# EAGLE design solar_charger_fuel_gauge_dev (EAGLE 6.6.0)
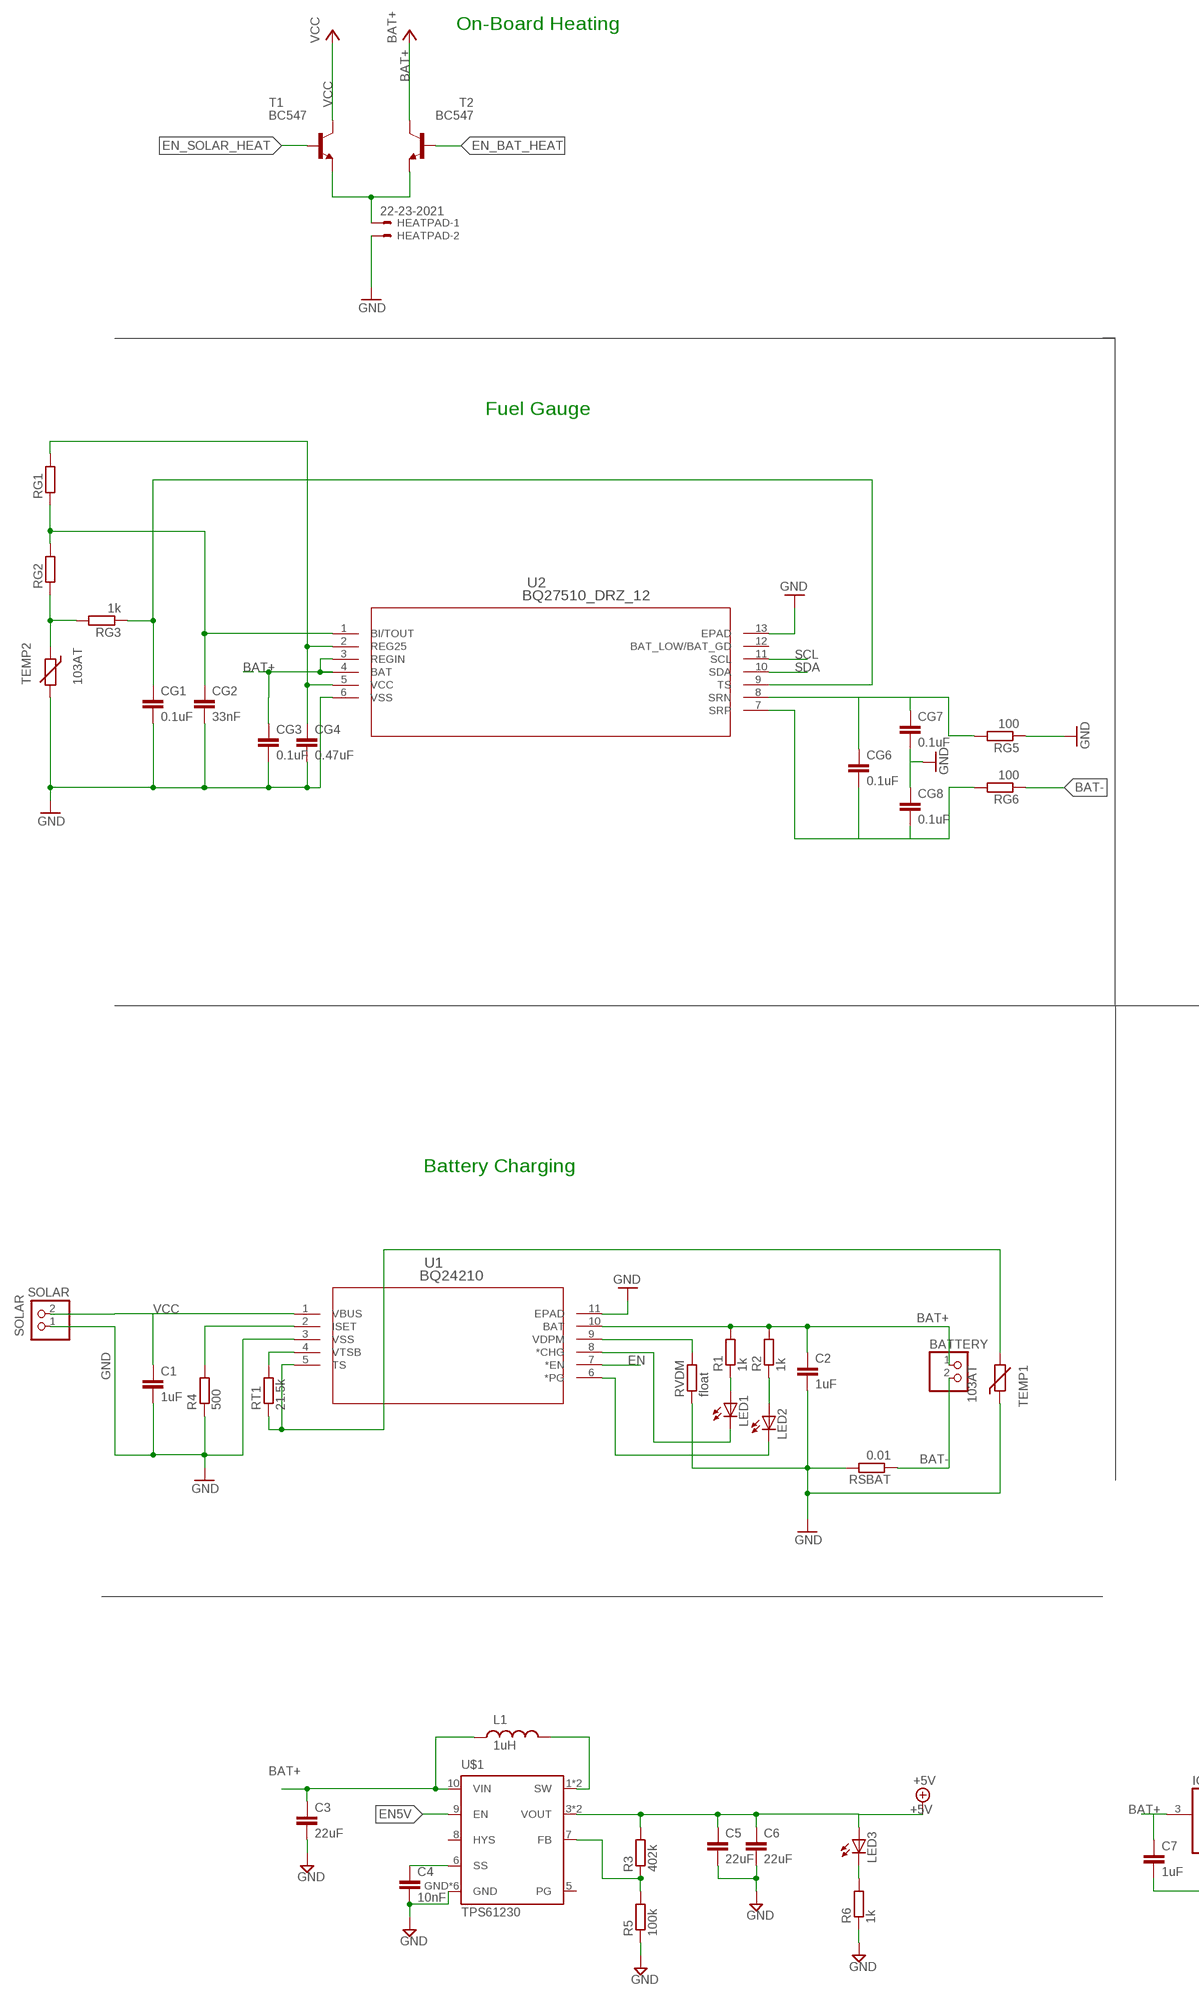
[diagram p0: schematic, sheet 1, part 1 of 3]
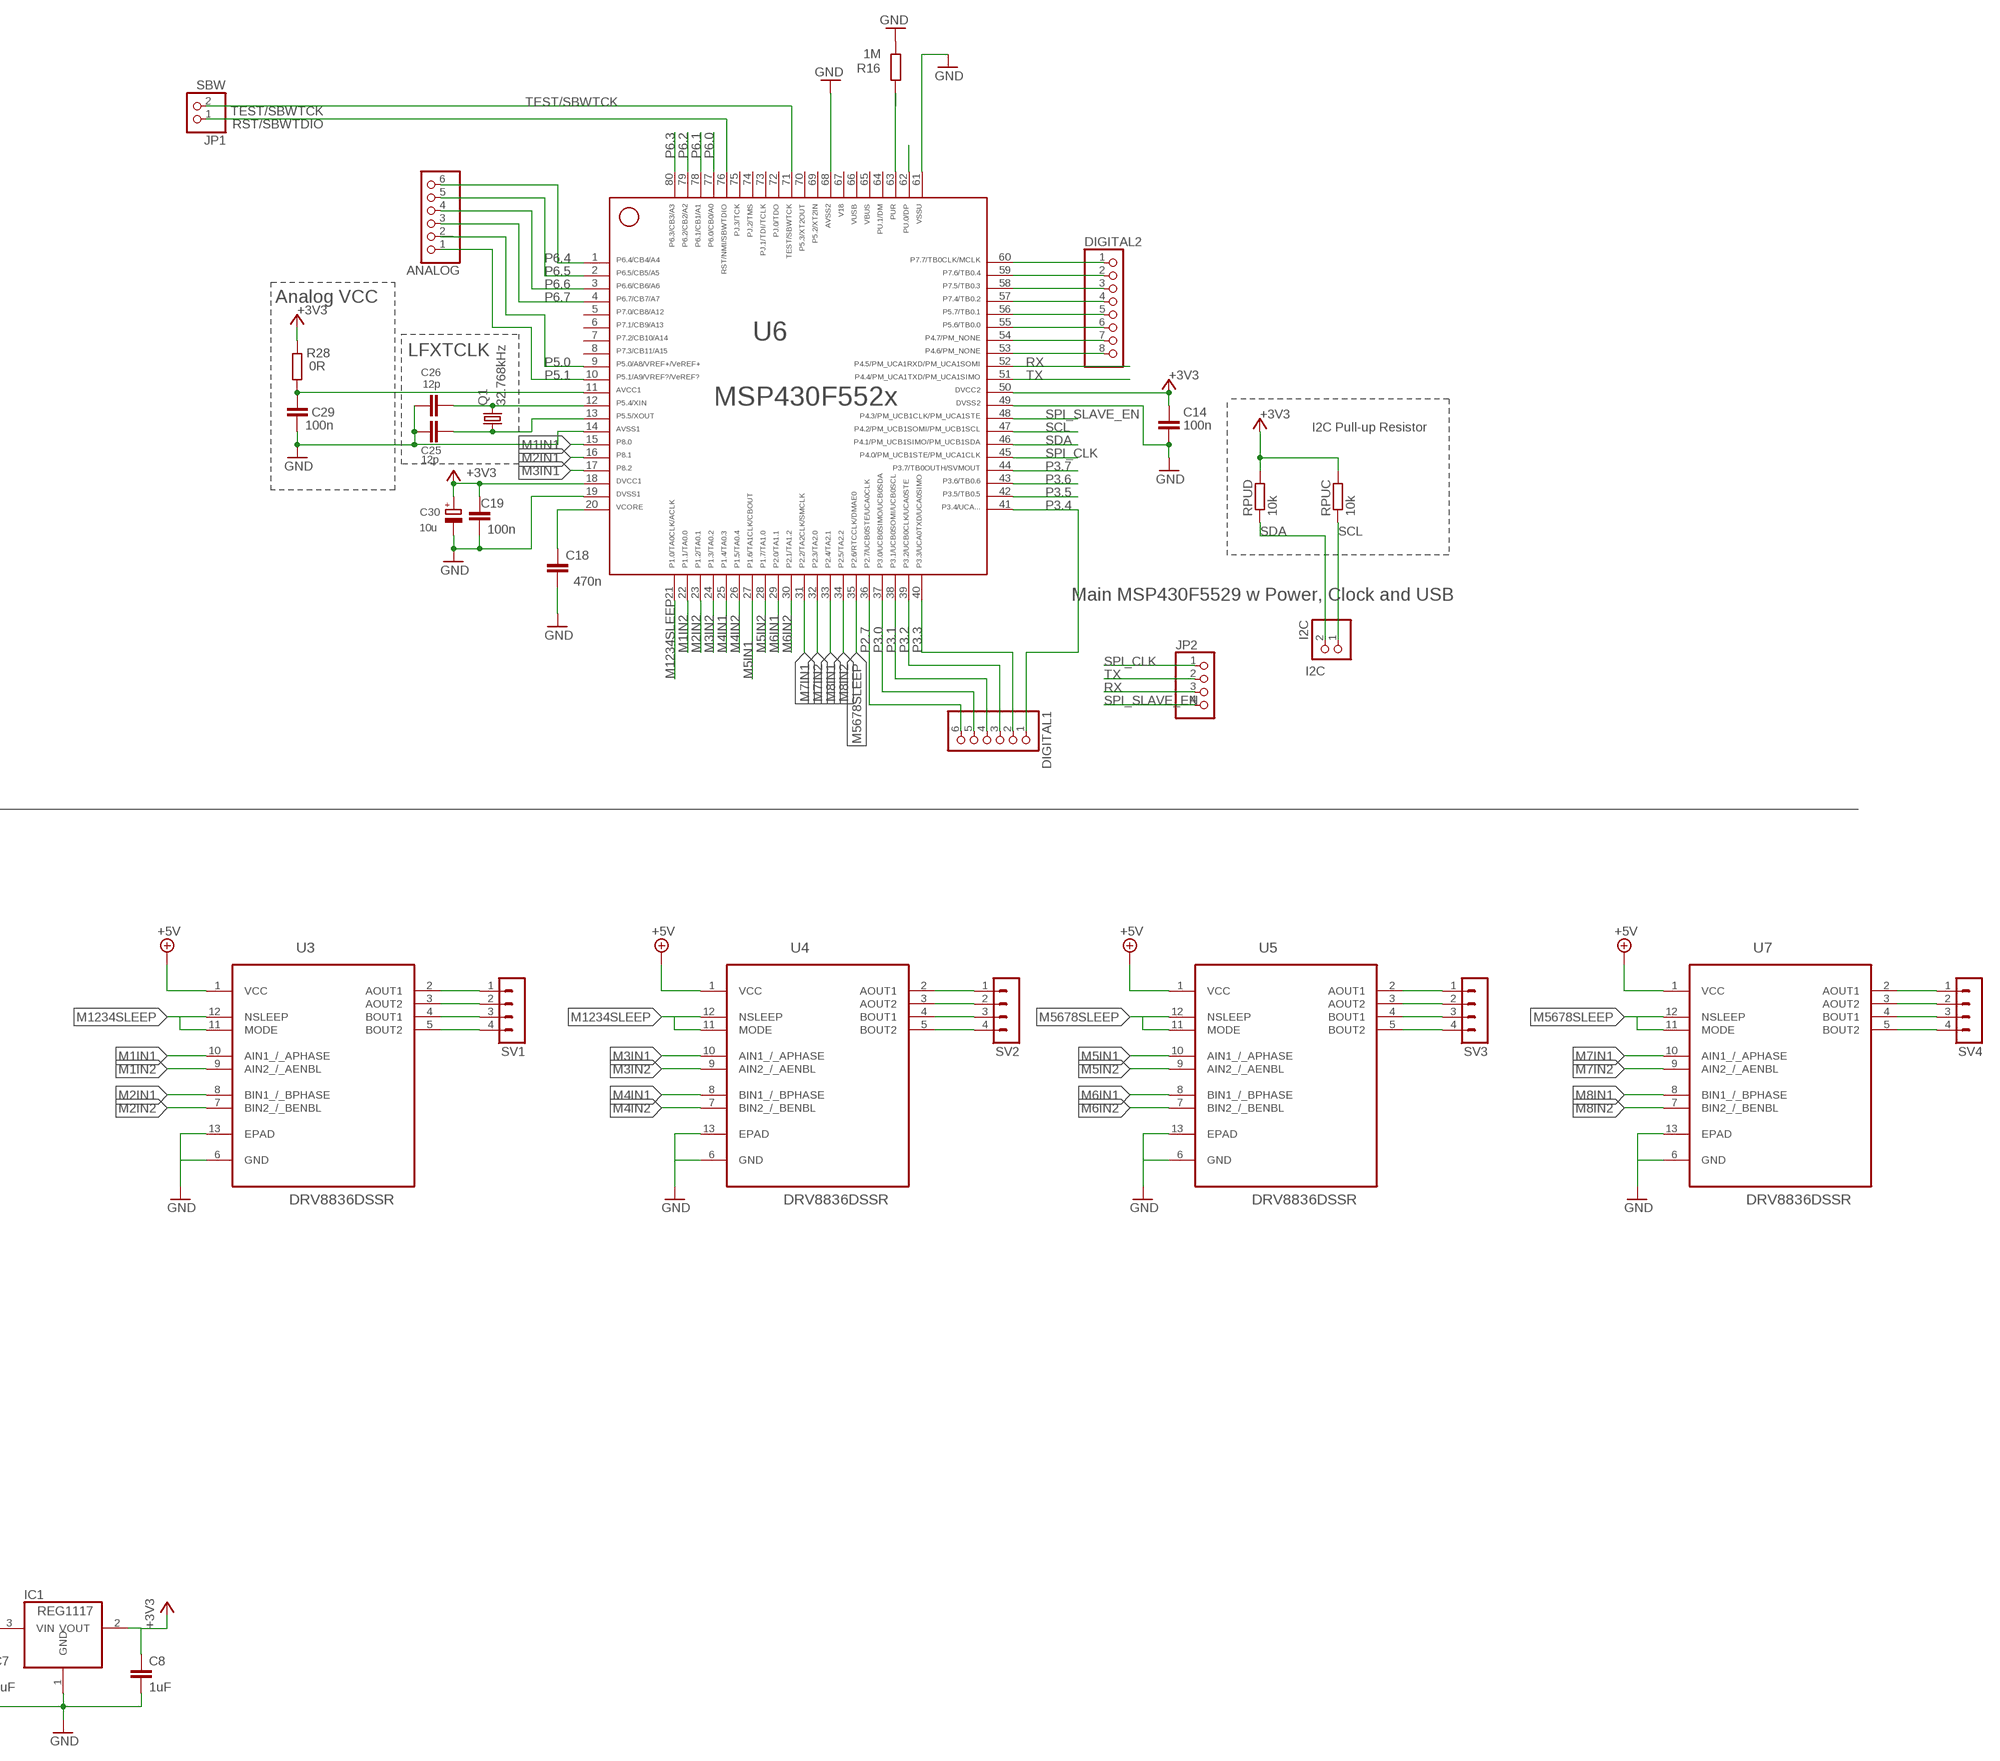
[diagram p1: schematic, sheet 1, part 2 of 3]
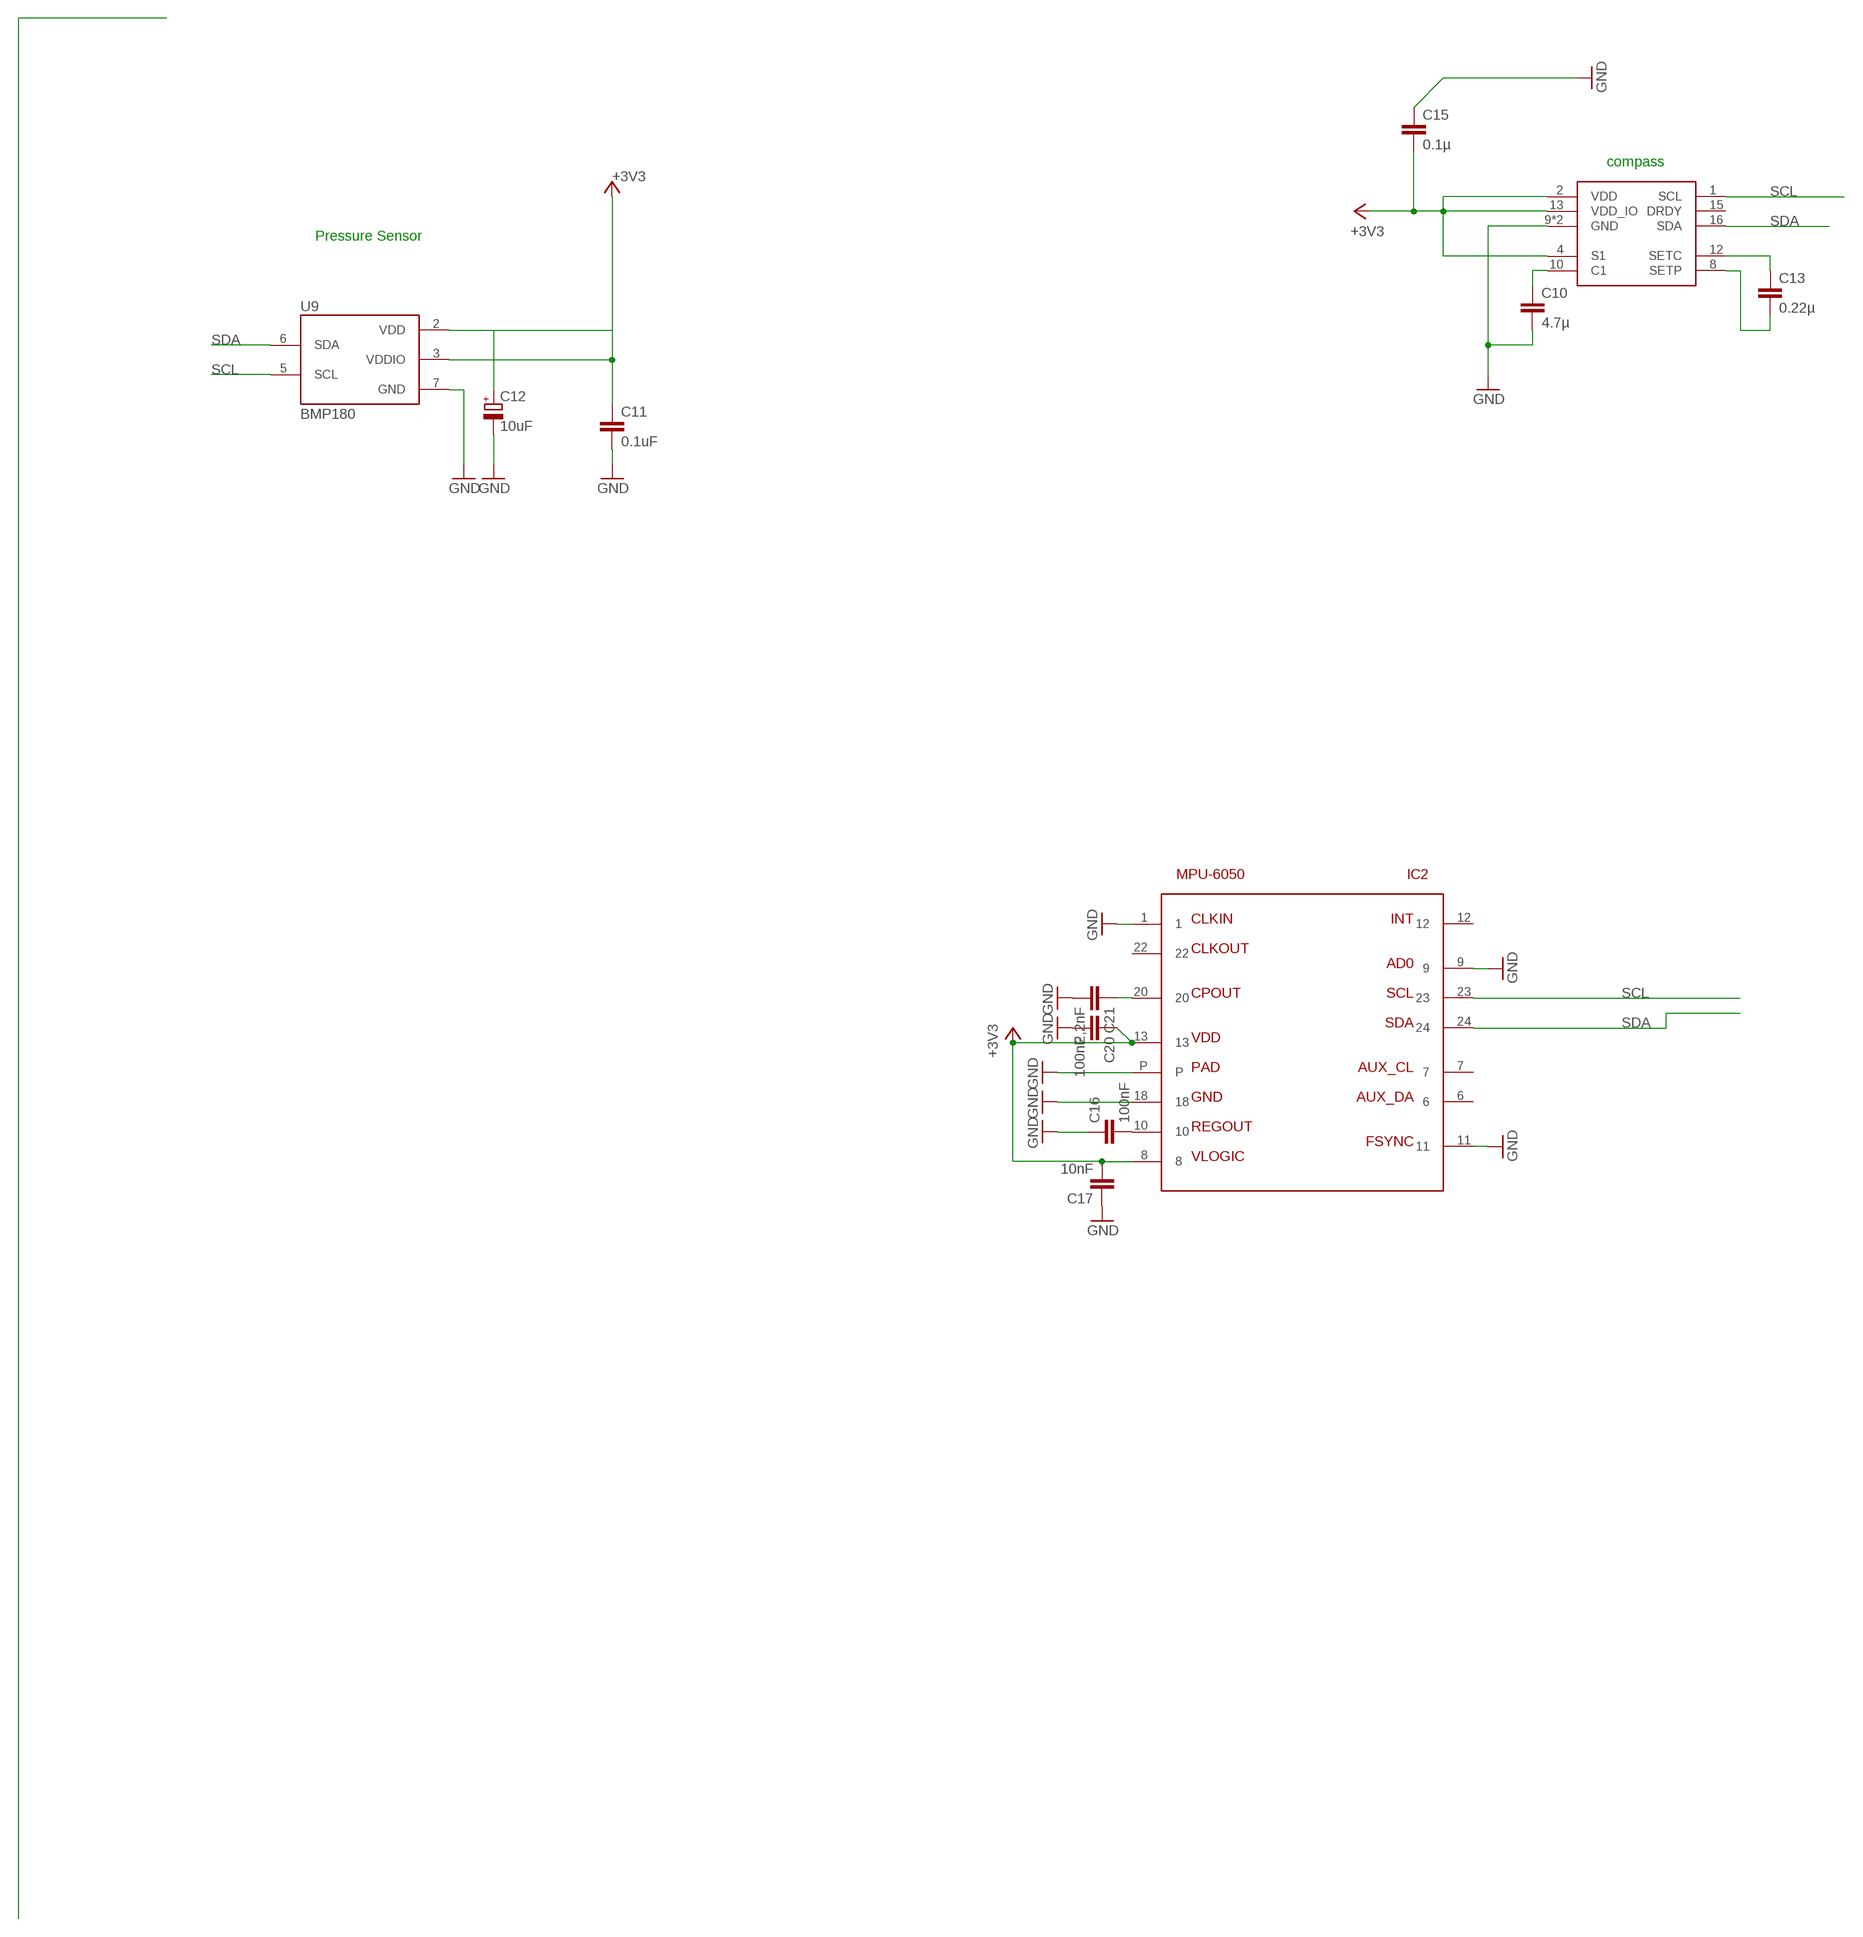
[diagram p2: schematic, sheet 1, part 3 of 3]

## Parts
ANALOG  PINHD-1X6  [1X06]
BATTERY  PINHD-1X2  [1X02]
C1  1uF  C-EUC1206  [C1206]
C2  1uF  C-EUC1206  [C1206]
C3  22uF  C-EUC0603  [C0603]
C4  10nF  C-EUC0603  [C0603]
C5  22uF  C-EUC0603  [C0603]
C6  22uF  C-EUC0603  [C0603]
C7  1uF  C-EUC0603  [C0603]
C8  1uF  C-EUC0603  [C0603]
C10  4.7µ  C-EUC0603  [C0603]
C11  0.1uF  C-EUC0603  [C0603]
C12  10uF  CPOL-EUA/3216-18R  [A/3216-18R]
C13  0.22µ  C-EUC0603  [C0603]
C14  100n  C-EUC0603  [C0603]
C15  0.1µ  C-EUC0603  [C0603]
C16  100nF  C-EUC0603  [C0603]
C17  10nF  C-EUC0603  [C0603]
C18  470n  C-EUC0603  [C0603]
C19  100n  C-EUC0603  [C0603]
C20  100nF  C-EUC0603  [C0603]
C21  2,2nF  C-EUC0603  [C0603]
C25  12p  C-EUC0603  [C0603]
C26  12p  C-EUC0603  [C0603]
C29  100n  C-EUC0603  [C0603]
C30  10u  CPOL-EUA/3216-18R  [A/3216-18R]
CG1  0.1uF  C-EUC0603  [C0603]
CG2  33nF  C-EUC0603  [C0603]
CG3  0.1uF  C-EUC0603  [C0603]
CG4  0.47uF  C-EUC0603  [C0603]
CG6  0.1uF  C-EUC0603  [C0603]
CG7  0.1uF  C-EUC0603  [C0603]
CG8  0.1uF  C-EUC0603  [C0603]
COMPASS  HMC5883L  [LPCC16]
DIGITAL1  PINHD-1X6  [1X06]
DIGITAL2  PINHD-1X8  [1X08]
HEATPAD  22-23-2021  [22-23-2021]
I2C  I2C  PINHD-1X2  [1X02]
IC1  REG1117  [SOT223]
IC2  MPU-6050  [QFN24]
JP1  SBW  PINHD-1X2  [1X02]
JP2  PINHD-1X4  [1X04]
L1  1uH  XFL4020  [XFL4020]
LED1  LEDCHIP-LED0603  [CHIP-LED0603]
LED2  LEDCHIP-LED0603  [CHIP-LED0603]
LED3  LEDCHIPLED_0603  [CHIPLED_0603]
Q1  32.768kHz  FC-12M  [FC-12M]
R1  1k  R-EU_R0603  [R0603]
R2  1k  R-EU_R0603  [R0603]
R3  402k  R-EU_R0603  [R0603]
R4  500  R-EU_R1206  [R1206]
R5  100k  R-EU_R0603  [R0603]
R6  1k  R-EU_R0603  [R0603]
R16  1M  R-EU_R0603  [R0603]
R28  0R  R-EU_R0603  [R0603]
RG1  R-EU_R0603  [R0603]
RG2  R-EU_R0603  [R0603]
RG3  1k  R-EU_R0603  [R0603]
RG5  100  R-EU_R0603  [R0603]
RG6  100  R-EU_R0603  [R0603]
RPUC  10k  R-EU_R0603  [R0603]
RPUD  10k  R-EU_R0603  [R0603]
RSBAT  0.01  R-EU_R1206  [R1206]
RT1  21.5k  R-EU_R1206  [R1206]
RVDM  float  R-EU_R1206  [R1206]
SOLAR  SOLAR  PINHD-1X2  [1X02]
SV1  MA04-1  [MA04-1]
SV2  MA04-1  [MA04-1]
SV3  MA04-1  [MA04-1]
SV4  MA04-1  [MA04-1]
T1  BC547  [TO92]
T2  BC547  [TO92]
TEMP1  103AT  THERMISTOR-2,5  [RS-2,5]
TEMP2  103AT  THERMISTOR-2,5  [RS-2,5]
U1  BQ24210  BQ24210_DQC_10  [DQC10_P84X2P4]
U2  BQ27510_DRZ_12  [DRZ12_1P95X2P45]
U3  DRV8836DSSR  [SON50P200X300X80-13N]
U4  DRV8836DSSR  [SON50P200X300X80-13N]
U5  DRV8836DSSR  [SON50P200X300X80-13N]
U6  MSP430F5529IPNR  F552X---PN80  [PN80]
U7  DRV8836DSSR  [SON50P200X300X80-13N]
U9  BMP180  [BMP180]
U$1  TPS61230  [DRC-S-PVSON-N11]

## Nets
+3V3: C8.1 C11.1 C12.+ C14.1 C15.2 C17.2 C19.2 C20.1 C30.+ COMPASS.2(VDD) COMPASS.4(S1) COMPASS.13(VDD_IO) IC1.2(VOUT) IC2.8 IC2.13 R28.2 RPUC.2 RPUD.2 U6.18 U6.50 U9.2(VDD) U9.3(VDDIO)
+5V [hPower]: C5.1 C6.1 LED3.A R3.2 U3.1(VCC) U4.1(VCC) U5.1(VCC) U7.1(VCC) U$1.3(VOUT) U$1.4(VOUT)
AVCC [Power]: C29.1 R28.1 U6.11
BAT+ [hPower]: BATTERY.1 C2.1 C3.1 C7.1 CG3.1 IC1.3(VIN) L1.P$1 R1.2 R2.2 T2.3(C) U1.10(BAT) U2.3(REGIN) U2.4(BAT) U$1.10(VIN)
BAT- [hGround]: BATTERY.2 RG6.1 RSBAT.1
EN: U1.7(*EN)
EN5V: U$1.9(EN)
EN_BAT_HEAT: T2.2(B)
EN_SOLAR_HEAT: T1.2(B)
GND [Ground]: C1.2 C2.2 C3.2 C4.2 C5.2 C6.2 C7.2 C8.2 C10.2 C11.2 C12.- C14.2 C15.1 C16.1 C17.1 C18.1 C19.1 C20.2 C21.2 C25.1 C26.1 C29.2 C30.- CG1.2 CG2.2 CG3.2 CG4.2 CG7.2 CG8.1 COMPASS.9(GND) COMPASS.11(GND) HEATPAD.2 IC1.1(GND) IC2.1 IC2.9 IC2.11 IC2.18 IC2.P R4.1 R5.1 R6.1 R16.1 RG5.1 RSBAT.2 RVDM.1 SOLAR.1 TEMP1.1 TEMP2.2 U1.3(VSS) U1.11(EPAD) U2.6(VSS) U2.13(EPAD) U3.6(GND) U3.13(EPAD) U4.6(GND) U4.13(EPAD) U5.6(GND) U5.13(EPAD) U6.14 U6.19 U6.49 U6.61 U6.68 U7.6(GND) U7.13(EPAD) U9.7(GND) U$1.GND U$1.GND@1(GND) U$1.GND@2(GND) U$1.GND@3(GND) U$1.GND@4(GND) U$1.GND@5(GND)
IND: L1.P$2 U$1.1(SW) U$1.2(SW)
M1IN1: U3.10(AIN1_/_APHASE) U6.15
M1IN2: U3.9(AIN2_/_AENBL) U6.22
M2IN1: U3.8(BIN1_/_BPHASE) U6.16
M2IN2: U3.7(BIN2_/_BENBL) U6.23
M3IN1: U4.10(AIN1_/_APHASE) U6.17
M3IN2: U4.9(AIN2_/_AENBL) U6.24
M4IN1: U4.8(BIN1_/_BPHASE) U6.25
M4IN2: U4.7(BIN2_/_BENBL) U6.26
M5IN1: U5.10(AIN1_/_APHASE) U6.27
M5IN2: U5.9(AIN2_/_AENBL) U6.28
M6IN1: U5.8(BIN1_/_BPHASE) U6.29
M6IN2: U5.7(BIN2_/_BENBL) U6.30
M7IN1: U6.31 U7.10(AIN1_/_APHASE)
M7IN2: U6.32 U7.9(AIN2_/_AENBL)
M8IN1: U6.33 U7.8(BIN1_/_BPHASE)
M8IN2: U6.34 U7.7(BIN2_/_BENBL)
M1234SLEEP: U3.11(MODE) U3.12(NSLEEP) U4.11(MODE) U4.12(NSLEEP) U6.21
M5678SLEEP: U5.11(MODE) U5.12(NSLEEP) U6.35 U7.11(MODE) U7.12(NSLEEP)
N$1: CG2.1 RG1.1 RG2.2 U2.1(BI/TOUT)
N$2: LED1.A R1.1
N$3: LED2.A R2.1
N$4: LED1.C U1.8(*CHG)
N$5: LED2.C U1.6(*PG)
N$6: RVDM.2 U1.9(VDPM)
N$7: RT1.1 TEMP1.2 U1.5(TS)
N$8: RT1.2 U1.4(VTSB)
N$10: R4.2 U1.2(ISET)
N$13: SV2.1 U4.2(AOUT1)
N$14: DIGITAL2.1 U6.60
N$15: DIGITAL2.2 U6.59
N$17: C10.1 COMPASS.10(C1)
N$18: C16.2 IC2.10
N$19: C21.1 IC2.20
N$20: DIGITAL2.3 U6.58
N$21: DIGITAL2.4 U6.57
N$22: DIGITAL2.5 U6.56
N$23: DIGITAL2.6 U6.55
N$24: DIGITAL2.7 U6.54
N$25: C13.2 COMPASS.8(SETP)
N$26: DIGITAL2.8 U6.53
N$32: C13.1 COMPASS.12(SETC)
N$33: RG2.1 RG3.2 TEMP2.1
N$34: CG1.1 RG3.1 U2.9(TS)
N$35: CG4.1 RG1.2 U2.2(REG25) U2.5(VCC)
N$36: CG6.1 CG7.1 RG5.2 U2.8(SRN)
N$37: HEATPAD.1 T1.1(E) T2.1(E)
N$38: CG6.2 CG8.2 RG6.2 U2.7(SRP)
N$39: SV2.2 U4.3(AOUT2)
N$40: SV2.3 U4.4(BOUT1)
N$41: SV2.4 U4.5(BOUT2)
N$42: C4.1 U$1.6(SS)
N$43: R3.1 R5.2 U$1.7(FB)
N$44: LED3.C R6.2
N$45: SV3.1 U5.2(AOUT1)
N$46: SV3.2 U5.3(AOUT2)
N$47: SV3.3 U5.4(BOUT1)
N$48: SV3.4 U5.5(BOUT2)
N$49: SV1.1 U3.2(AOUT1)
N$50: SV1.2 U3.3(AOUT2)
N$51: SV1.3 U3.4(BOUT1)
N$52: SV1.4 U3.5(BOUT2)
N$53: SV4.1 U7.2(AOUT1)
N$54: SV4.2 U7.3(AOUT2)
N$55: SV4.3 U7.4(BOUT1)
N$56: SV4.4 U7.5(BOUT2)
P2.7: DIGITAL1.6 U6.36
P3.0: DIGITAL1.5 U6.37
P3.1: DIGITAL1.4 U6.38
P3.2: DIGITAL1.3 U6.39
P3.3: DIGITAL1.2 U6.40
P3.4: DIGITAL1.1 U6.41
P3.5: U6.42
P3.6: U6.43
P3.7: U6.44
P5.0: ANALOG.2 U6.9
P5.1: ANALOG.1 U6.10
P5.4/XIN: C26.2 Q1.2 U6.12
P5.5/XOUT: C25.2 Q1.1 U6.13
P6.0: U6.77
P6.1: U6.78
P6.2: U6.79
P6.3: U6.80
P6.4: ANALOG.6 U6.1
P6.5: ANALOG.5 U6.2
P6.6: ANALOG.4 U6.3
P6.7: ANALOG.3 U6.4
RST/SBWTDIO: JP1.1 U6.76
RX: JP2.3 U6.52
SCL: COMPASS.1(SCL) I2C.1 IC2.23 RPUC.1 U2.11(SCL) U6.47 U9.5(SCL)
SDA: COMPASS.16(SDA) I2C.2 IC2.24 RPUD.1 U2.10(SDA) U6.46 U9.6(SDA)
SPI_CLK: JP2.1 U6.45
SPI_SLAVE_EN: JP2.4 U6.48
TARGET_DP: U6.62
TARGET_PUR: R16.2 U6.63
TEST/SBWTCK: JP1.2 U6.71
TX: JP2.2 U6.51
VCC: C1.1 SOLAR.2 T1.3(C) U1.1(VBUS)
VCORE [Power]: C18.2 U6.20
Unconnected: COMPASS.15(DRDY) IC2.6 IC2.7 IC2.12 IC2.22 U2.12(BAT_LOW/BAT_GD) U6.5 U6.6 U6.7 U6.8 U6.64 U6.69 U6.70 U6.72 U6.73 U6.74 U6.75 U$1.8(HYS)

## Notes on the sheet
- On-Board Heating
- compass
- Pressure Sensor
- Fuel Gauge
- Analog VCC
- LFXTCLK
- I2C Pull-up Resistor
- Main MSP430F5529 w Power, Clock and USB
- Battery Charging

## Power pins joined to a net without a drawn wire
65: U6.65
66: U6.66
67: U6.67
PG: U$1.5(PG)

## Library data of the parts
ANALOG DIGITAL1 = pinhead:PINHD-1X6: PIN HEADER
BATTERY I2C JP1 SOLAR = pinhead:PINHD-1X2: PIN HEADER
C1-C8 C10 C11 C13-C21 C25 C26 C29 CG1-CG4 CG6-CG8 = rcl:C-EU: CAPACITOR, European symbol
C12 = resistor:CPOL-EU: POLARIZED CAPACITOR, European symbol
C30 = rcl:CPOL-EU: POLARIZED CAPACITOR, European symbol
COMPASS = HMC5883L:HMC5883L
DIGITAL2 = pinhead:PINHD-1X8: PIN HEADER
HEATPAD = con-molex:22-23-2021: .100" (2.54mm) Center Header - 2 Pin; MF: MOLEX; MPN: 22-23-2021; OC_FARNELL: 1462926; OC_NEWARK: 25C3832
IC1 = burr-brown:REG1117: 800mA and 1A Low Dropout (LDO) Positive Regulator 1.8V, 2.5V, 2.85V, 3.3V, 5V, and Adj; MPN: REG1117; OC_FARNELL: 1097566; OC_NEWARK: 14P6981
IC2 = seb:MPU-6050
JP2 = pinhead:PINHD-1X4: PIN HEADER
L1 = Coilcraft:XFL4020
LED1 LED2 = led:LED: LED
LED3 = adafruit:LED: LED
Q1 = crystal:FC-12M: kHz RANGE CRYSTAL UNIT LOW PROFILE SMD Source: Epson Toyocom FC-12M.pdf; URL: http://www.mouser.ch/ProductDetail/ECS/ECS-327-125-12-TR/?qs=sGAEpiMZZMsBj6bBr9Q9adKxTNdvE4KvM1b8HDkgjuY%3d
R1-R3 R5 R6 R16 R28 RG1-RG3 RG5 RG6 RPUC RPUD = rcl:R-EU_: RESISTOR, European symbol
R4 RSBAT RT1 RVDM = resistor:R-EU_: RESISTOR, European symbol
SV1-SV4 = con-lstb:MA04-1: PIN HEADER; OC_FARNELL: unknown; OC_NEWARK: unknown
T1 T2 = transistor:BC547: NPN TRANSISTOR
TEMP1 TEMP2 = varistor:THERMISTOR: THERMISTOR
U1 = bq24210_dqc_10:BQ24210_DQC_10; DATASHEETURL: http://www.ti.com/lit/gpn/BQ24210; DESCRIPTION: 800mA, Single-Input, Single Cell Li-Ion Solar Battery Charger; FAMILY_NAME: BATTERY CHARGE MANAGEMENT; GENERIC_PART_NUMBER: BQ24210; INDUSTRY_STD_PKG_TYPE: WSON; MANUFACTURER: Texas Instruments; PACKAGE_DESIGNATOR: DQC; PIN_COUNT: 10
U2 = bq27510_drz_12:BQ27510_DRZ_12; DATASHEETURL: Unknown; DESCRIPTION: Unknown; FAMILY_NAME: Unknown; GENERIC_PART_NUMBER: BQ27510; INDUSTRY_STD_PKG_TYPE: Unknown; MANUFACTURER: Texas Instruments; PACKAGE_DESIGNATOR: DRZ; PIN_COUNT: 12
U3-U5 U7 = DRV8834:DRV8836DSSR: DUAL LOW VOLTAGE H-BRIDGE IC,SON-12; MPN: DRV8836DSSR; OC_FARNELL: 2115236; OC_NEWARK: 94T6066; PACKAGE: SON-12; SUPPLIER: TEXAS INSTRUMENTS
U6 = TI_MSP430_v16_intern:F552X---PN80: ***MSP430F552X***PN80 http://www.ti.com/lit/gpn/msp430f5529 Rev1.0 06/2010 For F552X where X is 1,5,7,9
U9 = SparkFun-Sensors:BMP180: BOSCH BMP180 DIGITAL BAROMETRIC PRESSURE SENSOR Web page: http://www.bosch-sensortec.com/en/homepage/products_3/environmental_sensors_1/bmp180_1/bmp180 Datasheet: http://ae-bst.resource.bosch.com/media/products/dokumente/bmp180/BST-BMP180-DS000-09.pdf The BMP180 is the function compatible successor of the BMP085, a new generation of high precision digital pressure sensors for consumer applications. The ultra-low power, low voltage electronics of the BMP180 is optimized for use in mobile phones, PDAs, GPS navigation devices and outdoor equipment. With a low altitude noise of merely 0.25m at fast conversion time, the BMP180 offers superior performance. The I2C interface allows for easy system integration with a microcontroller. The BMP180 is based on piezo-resistive technology for EMC robustness, high accuracy and linearity as well as long term stability. Key features: - Temperature measurement included - I2C interface - Fully calibrated - Pb-free, halogen-free and RoHS compliant, - MSL 1 Basic specs: Pressure range: 300 to 1100hPa (+9000m to -500m relating to sea level) Supply voltage: 1.8 to 3.6V (VDD), 1.62V to 3.6V (VDDIO) Package: LGA package with metal lid Small footprint: 3.6mm x 3.8mm Super-flat: 0.93mm height Low power: 5μA at 1 sample / sec. in standard mode Low noise: 0.06hPa (0.5m) in ultra low power mode, 0.02hPa (0.17m) advanced resolution mode Typical applications: - Enhancement of GPS navigation (dead-reckoning, slope detection, etc.) - In- and out-door navigation - Leisure and sports - Weather forecast - Vertical velocity indication (rise/sink speed)
U$1 = texas:TPS61230

## Net classes
0 Default: width 0.203 mm, drill 0.305 mm, clearance 0.152 mm
1 Ground: width 0.203 mm, drill 0.305 mm, clearance 0.152 mm
2 Power: width 0.203 mm, drill 0.305 mm, clearance 0.152 mm
3 hPower: width 0.406 mm, drill 0.61 mm, clearance 0.152 mm
4 hGround: width 0.406 mm, drill 0.61 mm, clearance 0.152 mm to class 0, clearance 0.152 mm

## Board
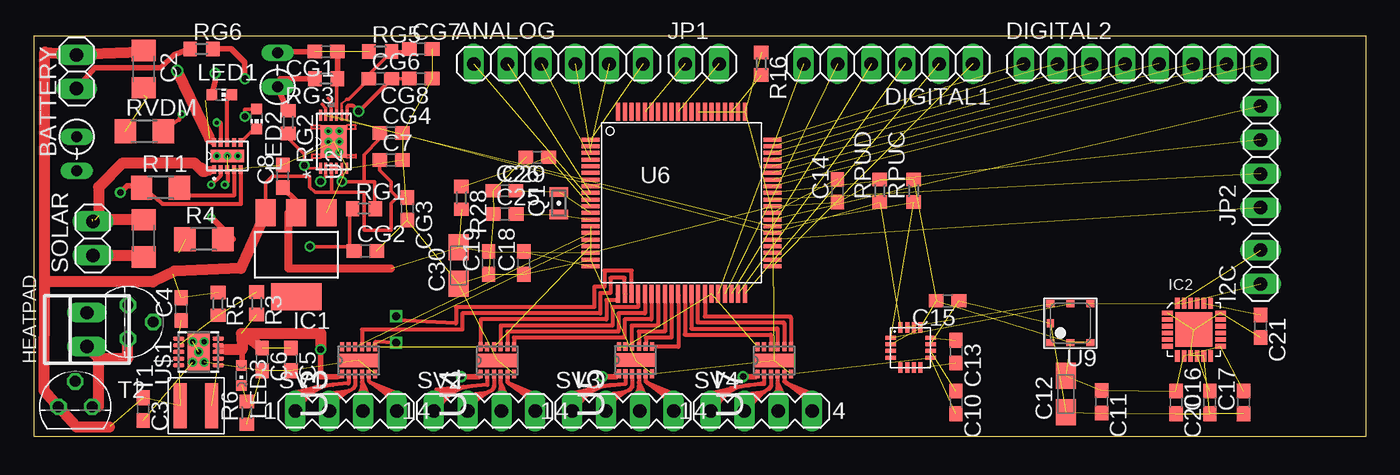
[diagram p3: board, top side]
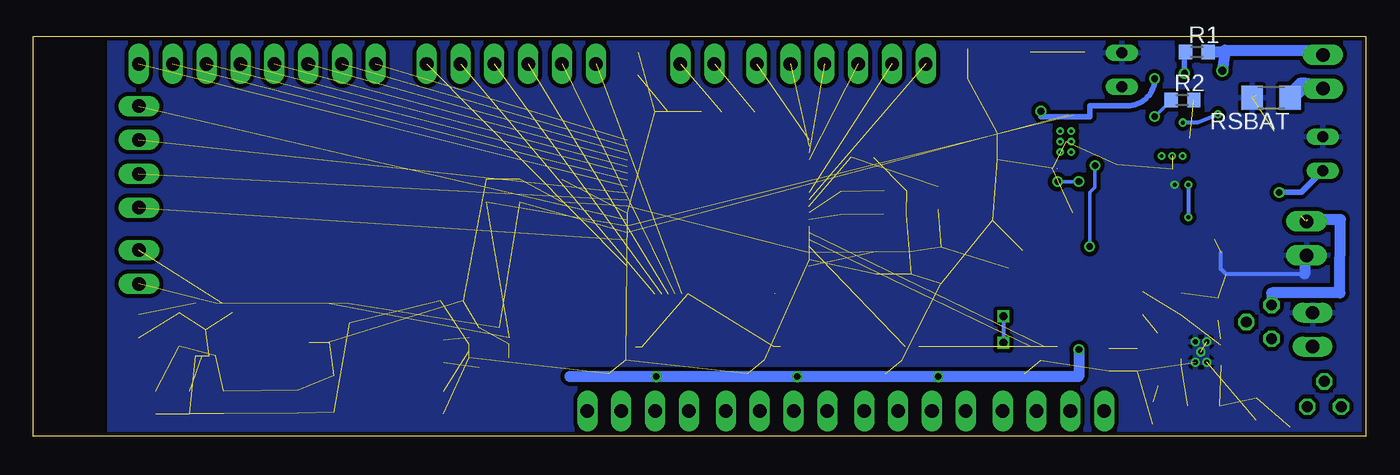
[diagram p4: board, bottom side, seen from below]

Size 100 x 30 mm. Coordinates in mm from the lower left corner, seen from the top.
Outline: 0,0 100,0 100,30 0,30 0,0
Copper layers (1*2*15*16): Top 0.035mm / dielectric 0.2mm / layer 2 0.0175mm / dielectric 1.1mm / layer 15 0.0175mm / dielectric 0.2mm / Bottom 0.035mm
Design rules "SeeedStudio_DRU_no_angle_20130527": minimum track width 6mil, minimum drill 12mil, track to track 6mil, track to pad 6mil, pad to pad 6mil, via to via 6mil, smd to smd 0mil, copper to edge 10mil, drill to drill 10mil, minimum pad ring 6mil, minimum via ring 6mil, stop-mask expansion 2mil, vias tented up to drill 25mil, thermal gap 10mil

### Footprints (pad centres in the part's own frame; a part is rotated, then mirrored left to right if it is on the bottom)
1X06 = drill 1.016 long: 1 -6.35,0; 2 -3.81,0; 3 -1.27,0; 4 1.27,0; 5 3.81,0; 6 6.35,0
1X02 = drill 1.016 long: 1 -1.27,0; 2 1.27,0
C1206 = smd 1.6 x 1.8: 1 -1.4,0; 2 1.4,0
C0603 = smd 1.1 x 1: 1 -0.85,0; 2 0.85,0
A/3216-18R = smd 1.95 x 1.5: + 1.375,0; - -1.375,0
LPCC16 = smd 0.8 x 0.3: 1 -1.5,0.75; 2 -1.5,0.25; 3 -1.5,-0.25; 4 -1.5,-0.75; 9 1.5,-0.75; 10 1.5,-0.25; 11 1.5,0.25; 12 1.5,0.75 | smd 0.3 x 0.8: 5 -0.75,-1.5; 6 -0.25,-1.5; 7 0.25,-1.5; 8 0.75,-1.5; 13 0.75,1.5; 14 0.25,1.5; 15 -0.25,1.5; 16 -0.75,1.5
1X08 = drill 1.016 long: 1 -8.89,0; 2 -6.35,0; 3 -3.81,0; 4 -1.27,0; 5 1.27,0; 6 3.81,0; 7 6.35,0; 8 8.89,0
22-23-2021 = drill 1 long: 1 -1.27,0; 2 1.27,0
SOT223 = smd 1.499 x 2.007: 1 -2.261,-3.15; 2 0.025,-3.15; 3 2.311,-3.15 | smd 3.81 x 2.007: 4 0,3.15
QFN24 = smd 0.8 x 0.35: 1 -2,1.25; 2 -2,0.75; 3 -2,0.25; 4 -2,-0.25; 5 -2,-0.75; 6 -2,-1.25; 13 2,-1.25; 14 2,-0.75; 15 2,-0.25; 16 2,0.25; 17 2,0.75; 18 2,1.25 | smd 0.35 x 0.85: 7 -1.25,-1.975; 8 -0.75,-1.975; 9 -0.25,-1.975; 10 0.25,-1.975; 11 0.75,-1.975; 12 1.25,-1.975; 19 1.25,1.975; 20 0.75,1.975; 21 0.25,1.975; 22 -0.25,1.975; 23 -0.75,1.975; 24 -1.25,1.975 | smd 2.8 x 2.6: P 0,0
1X04 = drill 1.016 long: 1 -3.81,0; 2 -1.27,0; 3 1.27,0; 4 3.81,0
XFL4020 = smd 0.965 x 3.353: P$1 -1.181,0; P$2 1.181,0
CHIP-LED0603 = smd 0.8 x 0.8: A 0,-0.75; C 0,0.75
CHIPLED_0603 = smd 0.8 x 0.8: A 0,-0.75; C 0,0.75
FC-12M = smd 0.7 x 1.4: 1 -0.85,0; 2 0.85,0
R0603 = smd 1 x 1.1: 1 -0.85,0; 2 0.85,0
R1206 = smd 1.6 x 1.803: 1 -1.422,0; 2 1.422,0
MA04-1 = drill 1.016 long: 1 -3.81,0; 2 -1.27,0; 3 1.27,0; 4 3.81,0
TO92 = drill 0.813 octagon: 1 1.27,0; 2 0,1.905; 3 -1.27,0
RS-2,5 = drill 0.813 long: 1 -1.27,0; 2 1.27,0
DQC10_P84X2P4 = smd 0.66 x 0.305: 1 -1.016,0.991; 2 -1.016,0.508; 3 -1.016,0; 4 -1.016,-0.508; 5 -1.016,-0.991; 6 1.016,-0.991; 7 1.016,-0.508; 8 1.016,0; 9 1.016,0.508; 10 1.016,0.991 | smd 0.94 x 2.515: 11 0,0 | drill 0.254: V 0,0.787; V_2 0,0; V_3 0,-0.787
DRZ12_1P95X2P45 = smd 0.838 x 0.203: 1 -1.981,0.991; 2 -1.981,0.61; 3 -1.981,0.203; 4 -1.981,-0.203; 5 -1.981,-0.61; 6 -1.981,-0.991; 7 1.981,-0.991; 8 1.981,-0.61; 9 1.981,-0.203; 10 1.981,0.203; 11 1.981,0.61; 12 1.981,0.991 | smd 2.438 x 1.956: 13 0,0 | drill 0.254: V 0.787,0.406; V_2 -0.787,0.406; V_3 -0.787,-0.406; V_4 0,-0.406; V_5 0,0.406; V_6 0.787,-0.406
SON50P200X300X80-13N = smd 0.66 x 0.305: 1 -1.016,1.245; 2 -1.016,0.762; 3 -1.016,0.254; 4 -1.016,-0.254; 5 -1.016,-0.762; 6 -1.016,-1.245; 7 1.016,-1.245; 8 1.016,-0.762; 9 1.016,-0.254; 10 1.016,0.254; 11 1.016,0.762; 12 1.016,1.245 | smd 0.991 x 3.099: 13 0,0
PN80 = smd 1.35 x 0.3: 1 -6.825,4.75; 2 -6.825,4.25; 3 -6.825,3.75; 4 -6.825,3.25; 5 -6.825,2.75; 6 -6.825,2.25; 7 -6.825,1.75; 8 -6.825,1.25; 9 -6.825,0.75; 10 -6.825,0.25; 11 -6.825,-0.25; 12 -6.825,-0.75; 13 -6.825,-1.25; 14 -6.825,-1.75; 15 -6.825,-2.25; 16 -6.825,-2.75; 17 -6.825,-3.25; 18 -6.825,-3.75; 19 -6.825,-4.25; 20 -6.825,-4.75; 41 6.825,-4.75; 42 6.825,-4.25; 43 6.825,-3.75; 44 6.825,-3.25; 45 6.825,-2.75; 46 6.825,-2.25; 47 6.825,-1.75; 48 6.825,-1.25; 49 6.825,-0.75; 50 6.825,-0.25; 51 6.825,0.25; 52 6.825,0.75; 53 6.825,1.25; 54 6.825,1.75; 55 6.825,2.25; 56 6.825,2.75; 57 6.825,3.25; 58 6.825,3.75; 59 6.825,4.25; 60 6.825,4.75 | smd 0.3 x 1.35: 21 -4.75,-6.825; 22 -4.25,-6.825; 23 -3.75,-6.825; 24 -3.25,-6.825; 25 -2.75,-6.825; 26 -2.25,-6.825; 27 -1.75,-6.825; 28 -1.25,-6.825; 29 -0.75,-6.825; 30 -0.25,-6.825; 31 0.25,-6.825; 32 0.75,-6.825; 33 1.25,-6.825; 34 1.75,-6.825; 35 2.25,-6.825; 36 2.75,-6.825; 37 3.25,-6.825; 38 3.75,-6.825; 39 4.25,-6.825; 40 4.75,-6.825; 61 4.75,6.825; 62 4.25,6.825; 63 3.75,6.825; 64 3.25,6.825; 65 2.75,6.825; 66 2.25,6.825; 67 1.75,6.825; 68 1.25,6.825; 69 0.75,6.825; 70 0.25,6.825; 71 -0.25,6.825; 72 -0.75,6.825; 73 -1.25,6.825; 74 -1.75,6.825; 75 -2.25,6.825; 76 -2.75,6.825; 77 -3.25,6.825; 78 -3.75,6.825; 79 -4.25,6.825; 80 -4.75,6.825
BMP180 = smd 0.6 x 0.5: 1 1.5,1.45; 2 0,1.45; 3 -1.5,1.45; 4 -1.5,-1.45; 5 0,-1.45; 6 1.5,-1.45 | smd 0.5 x 0.6: 7 1.5,0
DRC-S-PVSON-N11 = smd 0.28 x 0.85: 1 -1,-1.475; 2 -0.5,-1.475; 3 0,-1.475; 4 0.5,-1.475; 5 1,-1.475; 6 1,1.475; 7 0.5,1.475; 8 0,1.475; 9 -0.5,1.475; 10 -1,1.475 | smd 3.099 x 1.65: GND 0,0 | drill 0.381 pad 0.559: GND@1 0,0; GND@2 -0.762,0.432; GND@3 -0.762,-0.432; GND@4 0.762,0.432; GND@5 0.762,-0.432

### Placement (x,y rotation side)
ANALOG  39.37,27.94 0 top
BATTERY  3.23,27.34 270 top
C1  8.26,14.85 270 top
C2  8.26,27.55 270 top
C3  8.22,2.04 270 top
C4  11.07,9.54 90 top
C5  19.3,5.77 270 top
C6  17.14,5.77 270 top
C7  26.82,20.73 0 top
C8  18.69,19.51 90 top
C10  69.22,2.54 270 top
C11  80.14,2.59 270 top
C12  77.47,3.17 90 top
C13  69.22,6.35 270 top
C14  60.33,18.41 90 top
C15  68.58,10.16 180 top
C16  88.27,2.54 90 top
C17  90.81,2.54 90 top
C18  36.78,13 90 top
C19  34.14,13 90 top
C20  85.72,2.54 270 top
C21  92.08,8.26 270 top
C25  35.36,16.66 0 top
C26  35.33,18.41 0 top
C29  37.8,20.93 180 top
C30  31.9,12.8 90 top
CG1  21.95,28.85 180 top
CG2  24.89,13.9 0 top
CG3  28.04,17.07 270 top
CG4  26.82,22.76 0 top
CG6  26.01,26.82 0 top
CG7  29.05,29.06 0 top
CG8  29.05,26.83 180 top
COMPASS  65.81,6.65 0 top
DIGITAL1  64.14,27.94 180 top
DIGITAL2  83.19,27.94 0 top
HEATPAD  4,8 90 top
I2C  92.08,12.7 90 top
IC1  19.71,13.61 180 top
IC2  87.07,8 0 top
JP1  50.16,27.94 0 top
JP2  92.08,20.95 90 top
L1  12.19,2.29 0 top
LED1  14.12,25.62 270 top
LED2  16.74,23.79 180 top
LED3  15.6,4.55 180 top
Q1  39.42,17.48 90 top
R1  12.69,28.83 0 bottom
R2  13.75,25.22 0 bottom
R3  16.74,9.98 270 top
R4  12.78,14.79 0 top
R5  13.84,9.93 270 top
R6  16,1.75 90 top
R16  54.61,27.94 270 top
R28  32.11,17.88 270 top
RG1  24.79,17.07 0 top
RG2  19.1,23.57 270 top
RG3  21.95,26.82 180 top
RG5  26.01,28.85 0 top
RG6  12.6,29.06 0 top
RPUC  66.04,18.41 90 top
RPUD  63.5,18.41 90 top
RSBAT  7.12,25.4 180 bottom
RT1  9.53,18.66 0 top
RVDM  8.31,22.87 0 top
SOLAR  4.45,14.85 90 top
SV1  23.44,1.91 0 top
SV2  33.83,1.91 0 top
SV3  44.22,1.91 0 top
SV4  54.61,1.91 0 top
T1  7.07,8.57 270 top
T2  3.12,2.21 0 top
TEMP1  3.23,21.2 270 top
TEMP2  18.31,27.49 90 top
U1  14.54,21.03 90 top
U2  22.53,22.1 90 top
U3  24.38,5.69 90 top
U4  34.8,5.69 90 top
U5  45.16,5.71 90 top
U6  48.62,17.5 0 top
U7  55.58,5.69 90 top
U9  77.8,8.48 180 top
U$1  12.38,6.32 90 top

### Tracks (layer width: path | path; a pad name or v marks a point on that pad's centre or on a via)
+3V3  (20 unrouted)
  Top 0.406: IC1.2 19.68,17.67 C8.1
  Top 0.61: IC1.2 19.1,16.76 19.1,12.6 26.82,12.6
+5V  (via drill 0.5)  (2 unrouted)
  Top 0.305: U3.1 22.89,4.5 | U5.1 43.69,4.7 43.69,4.47 | U7.1 54.15,4.67 54.15,4.47 | U4.1 33.38,4.67 33.38,4.47
  Top 0.406: 13.85,6.5 U$1.4 | 14.43,6.5 13.85,6.5 | 13.85,6.5 U$1.3 | LED3.A 15.65,5.5 15.65,6.5 | 22.89,4.5 22.76,4.47 21.54,4.47 v21.54,6.5 | 43.69,4.47 v42.67,4.47 | 54.15,4.47 v53.24,4.47 | 33.38,4.47 v32.11,4.47
  Top 0.813: C6.1 15.61,7.72 | 15.61,7.72 15.65,6.5 14.43,6.5 | 15.61,7.72 21.54,7.72 v21.54,6.5
  Bottom 0.813: v21.54,6.5 21.54,4.47 v32.11,4.47 v42.67,4.47 v53.24,4.47 59.74,4.47
AVCC  (2 unrouted)
BAT+  (via drill 0.6)  (4 unrouted)
  Top 0.254: IC1.3 17.4,19.02 17.88,19.51 20.73,19.51 20.73,18.69 21.13,18.29 22.35,18.29 | 22.35,18.29 22.35,20.08 U2.3 U2.4 22.73,19.94 | CG3.1 27.27,17.92 | 27.27,17.92 26.82,17.48 26.82,15.44 24.79,15.44 24.79,18.29 22.35,18.29 | C7.1 25.97,19.95 26.82,19.1 26.82,18.36 27.27,17.92
  Top 0.305: U1.10 13.54,22.11 13.41,21.98 | 8.26,28.82 C2.1 | 13.41,21.98 13.41,21.95 | 13.41,21.98 13.41,22.35 13.21,22.35
  Top 0.813: 0.84,11.58 0.79,3.43 T2.3 3.2,0.71 5.69,0.71 | 0.84,11.58 0.84,28.82 BATTERY.1 8.12,28.82 C2.1 | 13.21,22.35 v10.77,27.43 | IC1.3 15.54,12.6 10.57,12.39 8.94,11.58 0.84,11.58
  Bottom 0.813: BATTERY.1 3.23,28.97 10.57,28.97 10.57,28.83 | 10.57,28.83 v10.77,27.43 | R1.2 10.57,28.83
BAT-
  Top 0.406: RG6.1 10.53,28.61 9.55,27.64 4.58,27.64 BATTERY.2
  Bottom 1.27: BATTERY.2 4.82,26.28 RSBAT.1
GND  (via drill 0.3)  (59 unrouted)
  Top 0.305: 8.26,26.17 C2.2 | U1.3 14.55,19.88 14.55,19.06 v14.35,18.86 | 8.26,13.58 C1.2 8.26,13.37
  Top 0.406: 8.26,26.23 8.26,26.17 8.26,25.59 | CG1.2 18.62,28.85 TEMP2.2
  Top 0.813: SOLAR.1 8.26,13.58
  Bottom 0.305: 10.9,13.78 10.9,12.56 10.49,12.15 4.6,12.15
  Bottom 0.813: 4.6,12.15 4.6,13.58 SOLAR.1
  pour Bottom (isolate 0.305): 0,30 94.28,30 94.28,0 0,0
IND  (2 unrouted)
M1IN1  (1 unrouted)
M1IN2  (1 unrouted)
  Top 0.305: 44.42,10.68 44.35,10.68 44.35,11.89 43.28,11.89 43.28,10.74 42.52,10.74 42.52,9.22 32.16,9.22 32.16,8 24.64,8 U3.9
M2IN1  (1 unrouted)
M2IN2  (via drill 0.6)
  Top 0.305: U6.23 44.88,10.68 44.88,12.42 42.82,12.42 42.82,11.2 42.06,11.2 42.06,9.68 31.7,9.68 31.7,8.46 27.2,8.69 v27.2,8.99 | v27.2,7.01 25.63,7.09 U3.7
  Bottom 0.305: v27.2,8.99 v27.2,7.01
M3IN1  (1 unrouted)
M3IN2
  Top 0.305: U6.24 45.34,10.68 45.34,9.68 43.43,9.68 43.43,8.31 35.05,8.31 U4.9
M4IN1
  Top 0.305: U6.25 45.87,9.22 43.89,9.22 43.89,7.85 35.56,7.85 U4.8
M4IN2
  Top 0.305: U6.26 46.37,8.76 44.35,8.76 44.35,7.39 36.04,7.39 U4.7
M5IN1
  Top 0.305: U6.27 46.87,8.31 44.88,8.31 44.88,6.73 U5.10
M5IN2
  Top 0.305: U6.28 47.37,7.85 45.41,7.85 U5.9
M6IN1
  Top 0.305: U6.29 47.87,7.39 45.95,7.39 45.95,6.73 U5.8
M6IN2
  Top 0.305: U6.30 arc90 48.39,10.62 48.39,6.71 arc90 48.28,6.73 U5.7
M7IN1
  Top 0.305: U6.31 48.87,7.62 55.32,7.62 U7.10
M7IN2
  Top 0.305: U6.32 49.37,8.08 55.78,8.08 arc-90 55.83,8.03 U7.9
M8IN1
  Top 0.305: U6.33 arc90 49.84,10.64 49.84,8.53 56.24,8.53 arc-90 56.34,8.43 U7.8
M8IN2
  Top 0.305: U6.34 50.37,8.99 56.69,8.99 arc-90 56.82,8.87 U7.7
M1234SLEEP  (2 unrouted)
  Top 0.305: U6.21 43.81,10.68 43.81,10.21 42.98,10.21 42.98,8.76 33.55,8.76 U4.12 U4.11
M5678SLEEP  (4 unrouted)
N$1  (via drill 0.5)
  Top 0.203: U2.1 20.32,20.11 v20.32,20.32
  Top 0.254: RG2.2 19.1,22.35 20.32,21.13 v20.32,20.32 | 23.72,14.22 v20.73,14.22 | 23.72,14.22 CG2.1 | 23.72,14.22 23.72,16.85 RG1.1
  Bottom 0.254: v20.73,14.22 20.73,18.29 20.32,18.69 v20.32,20.32
N$2  (via drill 0.5)
  Top 0.406: v13.61,27.23 13.61,26.59 LED1.A
  Bottom 0.406: R1.1 13.61,28.83 v13.61,27.23
N$3  (via drill 0.5)
  Top 0.254: LED2.A 15.85,24.54 v15.85,23.98
  Bottom 0.254: v15.85,23.98 R2.1
N$4
  Top 0.305: U1.8 14.54,25.28
  Top 0.406: 14.54,25.28 arc-90 LED1.C
N$5
  Top 0.254: LED2.C 16.52,23.04 U1.6
N$6  (via drill 0.3 pad 0.25)
  Top 0.305: v11.1,24.14 10.9,23.74 RVDM.2 | v13.74,23.53 14.03,23.53 U1.9
  Bottom 0.305: v11.1,24.14 12.72,23.53 v13.74,23.53
N$7  (via drill 0.5)
  Top 0.305: U1.5 15.57,19.88 15.57,17.44 9.68,17.44 8.26,18.61 RT1.1 8.05,18.81
  Top 0.406: 8.05,18.81 7.02,18.81 v6.5,18.29
  Bottom 0.406: v6.5,18.29 4.86,18.29 TEMP1.2
N$8
  Top 0.305: U1.4 15.05,18.05 11.56,18.05 RT1.2
N$10  (via drill 0.3 pad 0.25)
  Top 0.305: U1.2 14.03,19.55 v13.34,18.86
  Top 0.406: v13.34,16.42 14.96,14.79 R4.2
  Bottom 0.305: v13.34,18.86 v13.34,16.42
N$13
  Top 0.305: U4.2 34.04,3.86 30.23,3.5 SV2.1
N$14  (1 unrouted)
N$15  (1 unrouted)
N$17  (1 unrouted)
N$18  (1 unrouted)
N$19  (1 unrouted)
N$20  (1 unrouted)
N$21  (1 unrouted)
N$22  (1 unrouted)
N$23  (1 unrouted)
N$24  (1 unrouted)
N$25  (1 unrouted)
N$26  (1 unrouted)
N$32  (1 unrouted)
N$33
  Top 0.406: RG3.2 18.51,26.82 TEMP2.1 19.02,24.44 RG2.1
N$34
  Top 0.254: U2.9 22.73,26.75 RG3.1
  Top 0.406: CG1.1 RG3.1
N$35  (via drill 0.5)  (1 unrouted)
  Top 0.203: v23.14,19.1 23.14,20.08
  Top 0.254: U2.2 21.92,19.48 v21.54,19.1 | v23.14,19.1 24.79,19.1 | 24.79,19.1 25.6,19.1 25.6,17.07 RG1.2 | CG4.1 25.97,22.32 24.79,21.13 24.79,19.1
  Bottom 0.254: v21.54,19.1 v23.14,19.1
N$36
  Top 0.203: U2.8 23.11,24.1 23.11,24.94 23.47,25.3
  Top 0.254: 23.47,25.3 23.64,25.3 CG6.1 25.16,27.15 RG5.2 28,28.85 CG7.1
N$37
  Top 0.813: T1.1 7.07,5.87 4.88,5.87 | HEATPAD.1 4.88,5.87 | T2.1 4.88,2.23 4.88,5.87
N$38  (via drill 0.5)
  Top 0.254: 23.57,24.79 23.52,24.73 U2.7 | CG6.2 CG8.2
  Top 0.305: 23.57,24.79 23.98,24.79 v24.38,24.38 24.42,24.38 CG6.2
  Top 0.406: RG6.2 14.83,29.06 15.85,28.04 v15.85,26.82
  Bottom 0.406: v15.85,26.82 arc90 17.88,24.79 20.73,24.79 20.73,23.98 24.38,23.98 v24.38,24.38
N$39
  Top 0.305: U4.3 34.54,3.76 34.39,3.45 32.77,2.59 SV2.2
N$40
  Top 0.305: SV2.3 35.1,1.73 U4.4
N$41
  Top 0.305: SV2.4 37.54,2.85 35.66,3.96 35.56,4.06 U4.5
N$42  (1 unrouted)
N$43  (2 unrouted)
N$44  (1 unrouted)
N$45
  Top 0.305: U5.2 44.4,3.91 42.22,3.66 40.39,2.74 SV3.1
N$46
  Top 0.305: U5.3 44.91,3.71 44.76,3.5 43.28,2.79 SV3.2
N$47
  Top 0.305: U5.4 SV3.3
N$48
  Top 0.305: U5.5 45.92,4.12 48.01,2.74 SV3.4
N$49
  Top 0.305: U3.2 23.62,3.96 22.45,3.86 | 22.45,3.86 21.18,3.66 SV1.1 | 22.45,3.86 19.51,3.25 21.13,3.66 19.1,2.44 20.73,3.25 19.91,2.44
N$50
  Top 0.305: U3.3 24.13,3.81 24.03,3.61 23.67,3.4 | 23.67,3.4 22.35,2.44 22.35,2.85 | 22.35,2.85 22.35,3.25 23.67,3.4 | 23.67,3.4 22.35,2.85 | 22.35,2.85 SV1.2
N$51
  Top 0.305: U3.4 24.64,4.06 | 24.64,4.06 24.64,2.85 24.38,2.85 24.59,3.45 | 24.59,3.45 24.79,3.66 | 24.79,3.66 24.64,4.06 | 24.64,4.06 25.2,2.85 24.79,2.85 24.79,3.66 | 24.64,4.06 24.59,3.45 | 24.59,3.45 SV1.3
N$52
  Top 0.305: U3.5 25.15,4.17 26.62,3.05 25.25,4.06 27.23,3.25 26.31,3.4 SV1.4
N$53
  Top 0.305: U7.2 54.81,3.96 52.83,3.68 51.26,3 SV4.1
N$54
  Top 0.305: U7.3 55.32,3.71 54.61,3.15 SV4.2
N$55
  Top 0.305: U7.4 SV4.3
N$56
  Top 0.305: U7.5 56.34,4.12 58.52,2.69 SV4.4
N$57
  Top 0.305: 21.89,3.81 19.3,2.49 19.1,2.85
N$58
  Top 0.305: 34.04,4.57 34.04,3.86 32.87,3.76 | 32.87,3.76 31.6,3.56 30.05,1.8 | 32.87,3.76 29.92,3.15 31.55,3.56 29.52,2.34 31.14,3.15 30.33,2.34
N$59
  Top 0.305: 34.54,4.57 34.54,3.71 34.44,3.5 34.09,3.3 | 34.09,3.3 32.77,2.34 32.77,2.74 | 32.77,2.74 32.77,3.15 34.09,3.3 | 34.09,3.3 32.77,2.74 | 32.77,2.74 32.59,1.8
N$60
  Top 0.305: 35.05,4.57 35.05,3.96 | 35.05,3.96 35.05,2.74 34.8,2.74 35,3.35 | 35,3.35 35.2,3.56 | 35.2,3.56 35.05,3.96 | 35.05,3.96 35.61,2.74 35.2,2.74 35.2,3.56 | 35.05,3.96 35,3.35 | 35,3.35 35.13,1.8
N$61
  Top 0.305: 35.56,4.57 35.56,4.06 37.03,2.95 35.66,3.96 37.64,3.15 36.73,3.3 37.67,1.8
N$62
  Top 0.305: 32.31,3.71 29.72,2.39 29.52,2.74
N$63
  Top 0.305: 44.4,4.62 44.4,3.91 43.23,3.81 | 43.23,3.81 41.96,3.61 40.41,1.85 | 43.23,3.81 40.28,3.2 41.91,3.61 39.88,2.39 41.5,3.2 40.69,2.39
N$64
  Top 0.305: 44.91,4.62 44.91,3.76 44.81,3.56 44.45,3.35 | 44.45,3.35 43.13,2.39 43.13,2.79 | 43.13,2.79 43.13,3.2 44.45,3.35 | 44.45,3.35 43.13,2.79 | 43.13,2.79 42.95,1.85
N$65
  Top 0.305: 45.41,4.62 45.41,4.01 | 45.41,4.01 45.41,2.79 45.16,2.79 45.36,3.4 | 45.36,3.4 45.57,3.61 | 45.57,3.61 45.41,4.01 | 45.41,4.01 45.97,2.79 45.57,2.79 45.57,3.61 | 45.41,4.01 45.36,3.4 | 45.36,3.4 45.49,1.85
N$66
  Top 0.305: 45.92,4.62 45.92,4.12 47.4,3 46.02,4.01 48.01,3.2 47.09,3.35 48.03,1.85
N$67
  Top 0.305: 42.67,3.76 40.08,2.44 39.88,2.79
N$68
  Top 0.305: 54.81,4.57 54.81,3.91 53.65,3.81 | 53.65,3.81 52.38,3.61 50.83,1.85 | 53.65,3.81 50.7,3.2 52.32,3.61 50.29,2.39 51.92,3.2 51.1,2.39
N$69
  Top 0.305: 55.32,4.62 55.32,3.76 55.22,3.56 54.86,3.35 | 54.86,3.35 53.54,2.39 53.54,2.79 | 53.54,2.79 53.54,3.2 54.86,3.35 | 54.86,3.35 53.54,2.79 | 53.54,2.79 53.37,1.85
N$70
  Top 0.305: 55.83,4.62 55.83,4.01 | 55.83,4.01 55.83,2.79 55.58,2.79 55.78,3.4 | 55.78,3.4 55.98,3.61 | 55.98,3.61 55.83,4.01 | 55.83,4.01 56.39,2.79 55.98,2.79 55.98,3.61 | 55.83,4.01 55.78,3.4 | 55.78,3.4 55.91,1.85
N$71
  Top 0.305: 56.34,4.62 56.34,4.12 57.81,3 56.44,4.01 58.42,3.2 57.51,3.35 58.45,1.85
N$72
  Top 0.305: 52.83,3.68 50.49,2.44 50.29,2.79
P2.7  (1 unrouted)
P3.0  (1 unrouted)
P3.1  (1 unrouted)
P3.2  (1 unrouted)
P3.3  (1 unrouted)
P3.4  (1 unrouted)
P5.0  (1 unrouted)
P5.1  (1 unrouted)
P5.4/XIN  (2 unrouted)
P5.5/XOUT  (2 unrouted)
P6.4  (1 unrouted)
P6.5  (1 unrouted)
P6.6  (1 unrouted)
P6.7  (1 unrouted)
RST/SBWTDIO  (1 unrouted)
RX  (1 unrouted)
SCL  (6 unrouted)
  Top 0.254: U2.11 21.92,24.62 21.64,24.89
SDA  (6 unrouted)
  Top 0.254: U2.10 22.32,25.12 22.1,25.35
SPI_CLK  (1 unrouted)
SPI_SLAVE_EN  (1 unrouted)
TARGET_PUR  (1 unrouted)
TEST/SBWTCK  (1 unrouted)
TX  (1 unrouted)
VCC  (3 unrouted)
  Top 0.305: 4.6,16.22 8.26,16.22 C1.1 | U1.1 13.25,19.71 13.21,19.71 13.41,19.91 13.41,20.12 12.6,20.12
  Top 0.813: C1.1 4.34,16.25 | 12.6,20.12 12.84,19.88 12.7,19.88 12.06,20.51 6.69,20.51 4.88,18.69 4.88,16.55
  Bottom 0.813: 4.45,16.25 1.91,16.25 1.96,10.76 7.07,10.76 T1.3
VCORE  (1 unrouted)